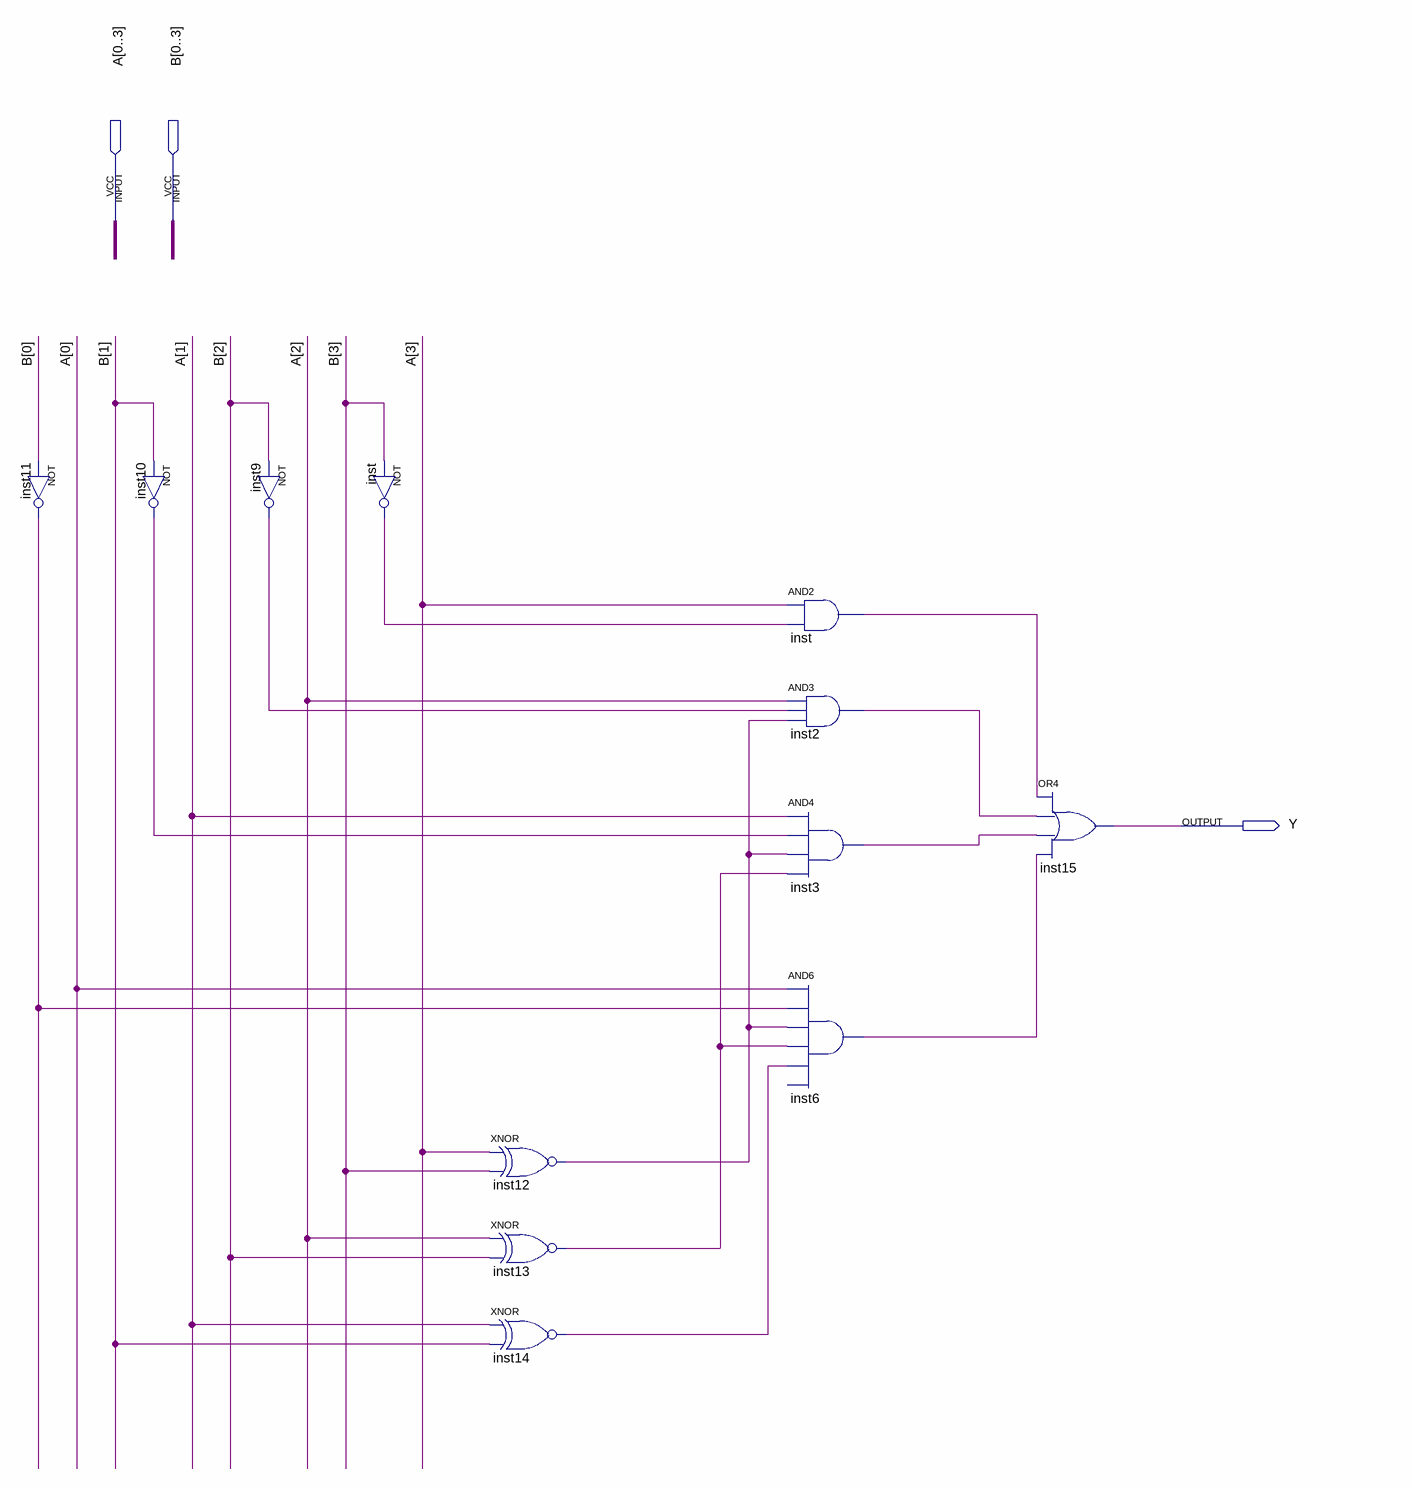
[diagram p0: schematic sheet]
// Quartus schematic Compare.bdf as structural Verilog: 12 symbols, 3 pins
module Compare (
  input  [0:3] A,
  input  [0:3] B,
  output Y
);

  wire inst2_out, inst3_out, inst6_out, inst9_out, inst10_out, inst11_out, inst12_out, inst13_out,
       inst14_out, inst_out, inst_out_2;

  not inst11 (inst11_out, B[0]);
  not inst10 (inst10_out, B[1]);
  not inst9 (inst9_out, B[2]);
  not inst (inst_out, B[3]);
  xnor inst12 (inst12_out, A[3], B[3]);
  xnor inst13 (inst13_out, A[2], B[2]);
  xnor inst14 (inst14_out, A[1], B[1]);
  and inst_dup2 (inst_out_2, A[3], inst_out);
  and inst2 (inst2_out, A[2], inst9_out, inst12_out);
  and inst3 (inst3_out, A[1], inst10_out, inst12_out, inst13_out);
  and inst6 (inst6_out, A[0], inst11_out, inst12_out, inst13_out, inst14_out);  // open: IN6
  or inst15 (Y, inst_out_2, inst2_out, inst3_out, inst6_out);
endmodule
